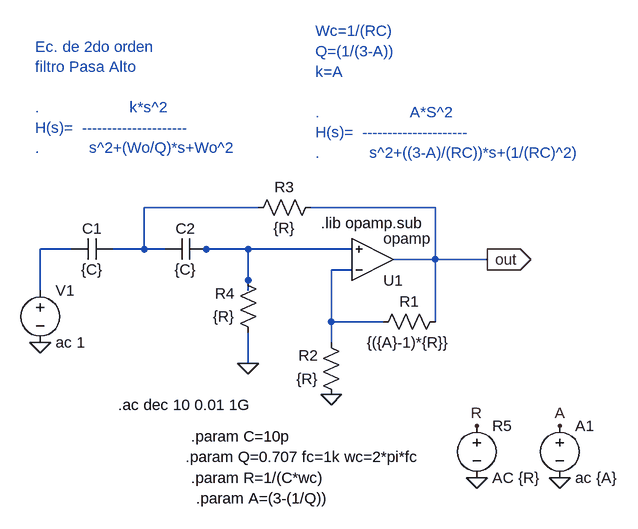
[diagram p0: schematic pasaalto.asc]
pasaalto.asc, the LTspice schematic file:
Version 4
SHEET 1 880 680
WIRE 192 48 16 48
WIRE 464 48 272 48
WIRE -96 112 -144 112
WIRE 16 112 16 48
WIRE 16 112 -32 112
WIRE 48 112 16 112
WIRE 112 112 96 112
WIRE 176 112 112 112
WIRE 336 112 176 112
WIRE 464 128 464 48
WIRE 464 128 400 128
WIRE 544 128 464 128
WIRE 336 144 304 144
WIRE 176 160 176 112
WIRE -144 176 -144 112
WIRE 176 176 176 160
WIRE 304 224 304 144
WIRE 384 224 304 224
WIRE 464 224 464 128
WIRE 304 256 304 224
WIRE 176 288 176 240
FLAG 176 288 0
FLAG 304 336 0
FLAG -144 256 0
FLAG 544 128 out
IOPIN 544 128 Out
FLAG 656 464 0
FLAG 528 464 0
FLAG 528 384 R
FLAG 656 384 A
SYMBOL OpAmps\\opamp 368 192 M180
SYMATTR InstName U1
SYMATTR SpiceLine2 GBW=100Meg
SYMBOL cap 48 128 R270
WINDOW 0 32 32 VTop 2
WINDOW 3 0 32 VBottom 2
SYMATTR InstName C2
SYMATTR Value {C}
SYMBOL res 480 208 R90
WINDOW 0 0 56 VBottom 2
WINDOW 3 32 56 VTop 2
SYMATTR InstName R1
SYMATTR Value {({A}-1)*{R}}
SYMBOL res 320 352 R180
WINDOW 0 36 76 Left 2
WINDOW 3 36 40 Left 2
SYMATTR InstName R2
SYMATTR Value {R}
SYMBOL res 288 32 R90
WINDOW 0 0 56 VBottom 2
WINDOW 3 32 56 VTop 2
SYMATTR InstName R3
SYMATTR Value {R}
SYMBOL res 192 256 R180
WINDOW 0 36 76 Left 2
WINDOW 3 36 40 Left 2
SYMATTR InstName R4
SYMATTR Value {R}
SYMBOL voltage -144 160 R0
WINDOW 123 0 0 Left 0
WINDOW 39 0 0 Left 0
SYMATTR InstName V1
SYMATTR Value ac 1
SYMBOL voltage 528 368 R0
SYMATTR InstName R5
SYMATTR Value AC {R}
SYMBOL voltage 656 368 R0
WINDOW 123 0 0 Left 0
WINDOW 39 0 0 Left 0
SYMATTR InstName A1
SYMATTR Value ac {A}
SYMBOL cap -96 128 R270
WINDOW 0 32 32 VTop 2
WINDOW 3 0 32 VBottom 2
SYMATTR InstName C1
SYMATTR Value {C}
TEXT 288 72 Left 2 !.lib opamp.sub
TEXT 280 -224 Left 2 ;Wc=1/(RC)\nQ=(1/(3-A))\nk=A\n \n.                    A*S^2\nH(s)=  ---------------------\n.           s^2+((3-A)/(RC))*s+(1/(RC)^2)
TEXT -152 -200 Left 2 ;Ec. de 2do orden \nfiltro Pasa Alto\n \n.                    k*s^2\nH(s)=  ---------------------\n.           s^2+(Wo/Q)*s+Wo^2
TEXT 88 400 Left 2 !.param C=10p
TEXT 80 432 Left 2 !.param Q=0.707 fc=1k wc=2*pi*fc
TEXT 88 464 Left 2 !.param R=1/(C*wc)
TEXT 96 496 Left 2 !.param A=(3-(1/Q))
TEXT -24 352 Left 2 !.ac dec 10 0.01 1G

The netlist it stands for:
* pasaalto.asc
XU1 N004 N003 out opamp Aol=100K GBW=100Meg  ; pins invin noninvin out
C2 N001 N003 {C}
R1 out N004 {({A}-1)*{R}}
R2 0 N004 {R}
R3 out N001 {R}
R4 0 N003 {R}
V1 N002 0 ac 1
V§R5 R 0 AC {R}
V§A1 A 0 ac {A}
C1 N002 N001 {C}
.lib opamp.sub
* Wc=1/(RC)
* Q=(1/(3-A))
* k=A
* .                    A*S^2
* H(s)=  ---------------------
* .           s^2+((3-A)/(RC))*s+(1/(RC)^2)
* Ec. de 2do orden
* filtro Pasa Alto
* .                    k*s^2
* H(s)=  ---------------------
* .           s^2+(Wo/Q)*s+Wo^2
.param C=10p
.param Q=0.707 fc=1k wc=2*pi*fc
.param R=1/(C*wc)
.param A=(3-(1/Q))
.ac dec 10 0.01 1G
.backanno
.end